# Altium schematic sheet Relay.SchDoc
size A4; SheetNumber: 6; SheetTotal: 8
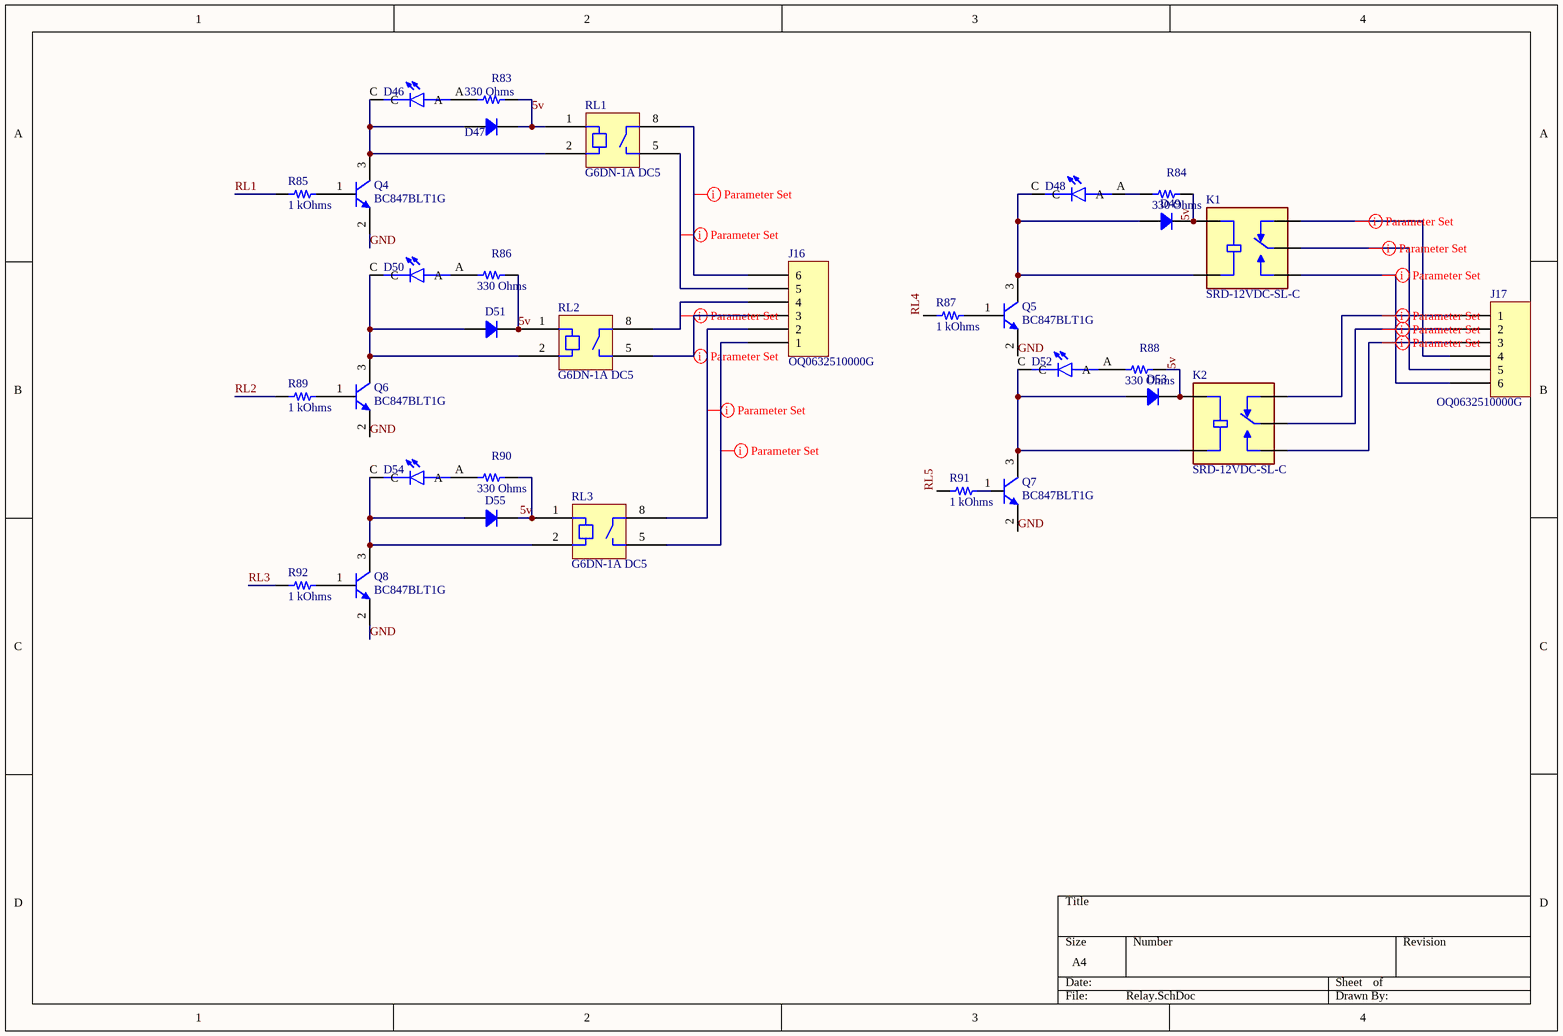
[diagram p0: Relay.SchDoc]

## Parts
D46  597-3305-607F  [LEDC2012X70N]  (value not drawn)
D47  CGRA4007-G  [DO214AC SMA]  (value not drawn)
D48  597-3305-607F  [LEDC2012X70N]  (value not drawn)
D49  CGRA4007-G  [DO214AC SMA]  (value not drawn)
D50  597-3305-607F  [LEDC2012X70N]  (value not drawn)
D51  CGRA4007-G  [DO214AC SMA]  (value not drawn)
D52  597-3305-607F  [LEDC2012X70N]  (value not drawn)
D53  CGRA4007-G  [DO214AC SMA]  (value not drawn)
D54  597-3305-607F  [LEDC2012X70N]  (value not drawn)
D55  CGRA4007-G  [DO214AC SMA]  (value not drawn)
J16  OQ0632510000G  [FCI 06-381-6PIN]
J17  OQ0632510000G  [FCI 06-381-6PIN]
K1  SRD-12VDC-SL-C  [RELAY_SRD-12VDC-SL-C]
K2  SRD-12VDC-SL-C  [RELAY_SRD-12VDC-SL-C]
Q4  BC847BLT1G  [ON SEMI SOT-23-3]
Q5  BC847BLT1G  [ON SEMI SOT-23-3]
Q6  BC847BLT1G  [ON SEMI SOT-23-3]
Q7  BC847BLT1G  [ON SEMI SOT-23-3]
Q8  BC847BLT1G  [ON SEMI SOT-23-3]
R83  330 Ohms  [RES 0805_2012]
R84  330 Ohms  [RES 0805_2012]
R85  1 kOhms  [RES 0805_2012]
R86  330 Ohms  [RES 0805_2012]
R87  1 kOhms  [RES 0805_2012]
R88  330 Ohms  [RES 0805_2012]
R89  1 kOhms  [RES 0805_2012]
R90  330 Ohms  [RES 0805_2012]
R91  1 kOhms  [RES 0805_2012]
R92  1 kOhms  [RES 0805_2012]
RL1  G6DN-1A DC5  [OMRON G6DN]
RL2  G6DN-1A DC5  [OMRON G6DN]
RL3  G6DN-1A DC5  [OMRON G6DN]

## Nets
5v: D47.2 D49.2 D51.2 D53.2 D55.2 K1.COIL1 K2.COIL1 R83.2 R84.2 R86.2 R88.2 R90.2 RL1.1(COIL1) RL2.1(COIL1) RL3.1(COIL1)
GND: Q4.2(E) Q5.2(E) Q6.2(E) Q7.2(E) Q8.2(E)
RL1: R85.1
RL2: R89.1
RL3: R92.1
RL4: R87.1
RL5: R91.1
NetD46_A: D46.A R83.1
NetD46_C: D46.C D47.1 Q4.3(C) RL1.2(COIL2)
NetD48_A: D48.A R84.1
NetD48_C: D48.C D49.1 K1.COIL2 Q5.3(C)
NetD50_A: D50.A R86.1
NetD50_C: D50.C D51.1 Q6.3(C) RL2.2(COIL2)
NetD52_A: D52.A R88.1
NetD52_C: D52.C D53.1 K2.COIL2 Q7.3(C)
NetD54_A: D54.A R90.1
NetD54_C: D54.C D55.1 Q8.3(C) RL3.2(COIL2)
NetJ16_1: J16.1 RL3.5(TERM1)
NetJ16_2: J16.2 RL3.8(TERM2)
NetJ16_3: J16.3 RL2.5(TERM1)
NetJ16_4: J16.4 RL2.8(TERM2)
NetJ16_5: J16.5 RL1.5(TERM1)
NetJ16_6: J16.6 RL1.8(TERM2)
NetJ17_1: J17.1 K2.NC
NetJ17_2: J17.2 K2.COM
NetJ17_3: J17.3 K2.NO
NetJ17_4: J17.4 K1.NC
NetJ17_5: J17.5 K1.COM
NetJ17_6: J17.6 K1.NO
NetQ4_1: Q4.1(B) R85.2
NetQ5_1: Q5.1(B) R87.2
NetQ6_1: Q6.1(B) R89.2
NetQ7_1: Q7.1(B) R91.2
NetQ8_1: Q8.1(B) R92.2

## Layout directives
net class High_current: NetJ16_1, NetJ16_2, NetJ16_3, NetJ16_4, NetJ16_5, NetJ16_6, NetJ17_1, NetJ17_2, NetJ17_3, NetJ17_4, NetJ17_5, NetJ17_6

## Library data of the parts
D46 D48 D50 D52 D54 = 597-3305-607F: LED Uni-Color Green 4-Pin Chip 0805 T/R; Availability: Unavailable; Value: *; Price: None; MP: 597-3305-607F; Package: None
D47 D49 D51 D53 D55 = CGRA4007-G: DIODE GEN PURP 1KV 1A DO214AC; Manufacturer: Comchip Technology; Current - Reverse Leakage @ Vr: 5 µA @ 1000 V; Diode Type: Standard; Speed: Standard Recovery >500ns, > 200mA (Io); Voltage - DC Reverse (Vr) (Max): 1000 V; Voltage - Forward (Vf) (Max) @ If: 1.1 V @ 1 A; Part Number: CGRA4007-G; ComponentLink1Description: Datasheet; ComponentLink1URL: http://www.comchiptech.com/admin/files/product/CGRA4001-G Thru647907. CGRA4007-G RevE.pdf; ComponentLink2Description: DigiKey Link; ComponentLink2URL: https://www.digikey.com/en/products/detail/comchip-technology/CGRA4007-G/1121050; Current - Average Rectified (Io): 1A; LastUpdated: 03-06-2024 7.54.36 PM; Lifecycle Status: Active; Minimum Order: 1; Mounting Type: Surface Mount; Operating Temperature - Junction: -55°C ~ 150°C; Package / Case: DO-214AC, SMA; Packaging: TapeAndReel; PartId: 670; Part Status: Active; Price: 0.04; Series: -; Supplier 1: DigiKey; Supplier Part Number 1: 641-1018-1-ND; Supplier Device Package: DO-214AC (SMA)
J16 J17 = OQ0632510000G: TERM BLOCK HDR 6POS 90DEG 3.81MM; Manufacturer: Amphenol Anytek; Current - UL: 10A; Header Orientation: 90°, Right Angle; Number of Levels: 1; Number of Positions: 6; Pitch: 0.150" (3.81mm); Voltage - UL: 300V; Part Number: OQ0632510000G; Color: Green; ComponentLink1Description: Datasheet; ComponentLink1URL: http://portal.fciconnect.com/Comergent//fci/drawing/oqxx32x100j0g.pdf; ComponentLink2Description: DigiKey Link; ComponentLink2URL: //digikey.com/product-detail/en/amphenol-anytek/OQ0632510000G/609-3823-ND/2261282; Contact Mating Finish: Tin; LastUpdated: 16-12-2019 7.16.11 PM; Lifecycle Status: 0; Minimum Order: 1; Mounting Type: Through Hole; Operating Temperature: -40°C ~ 115°C; Packaging: Bulk; Part Status: Active; Positions Per Level: 6; Price: 0.80; Series: 06-381; Supplier 1: DigiKey; Supplier Part Number 1: 609-3823-ND; Termination Style: Solder; Type: Header, Male Pins, Shrouded (4 Side)
K1 K2 = SRD-12VDC-SL-C: General Purpose Non Latching 12VDC SPDT Through Hole Relays RoHS; MF: Songle Relay; SnapEDA_Link: https://www.snapeda.com/parts/SRD-12VDC-SL-C/Songle+Relay/view-part/?ref=snap; Package: NON STANDARD-5 Songle Relay; Value: *; MP: SRD-12VDC-SL-C; Check_prices: https://www.snapeda.com/parts/SRD-12VDC-SL-C/Songle+Relay/view-part/?ref=eda
Q4-Q8 = BC847BLT1G: TRANS NPN 45V 0.1A SOT23; Manufacturer: ON Semiconductor; Current - Collector Cutoff (Max): 15nA (ICBO); Current - Collector (Ic) (Max): 100mA; DC Current Gain (hFE) (Min) @ Ic, Vce: 200 @ 2mA, 5V; Frequency - Transition: 100MHz; Power - Max: 300mW; Vce Saturation (Max) @ Ib, Ic: 600mV @ 5mA, 100mA; Part Number: BC847BLT1G; ComponentLink1Description: Datasheet; ComponentLink1URL: http://www.onsemi.com/pub/Collateral/BC846ALT1-D.PDF; ComponentLink2Description: DigiKey Link; ComponentLink2URL: http://digikey.com/product-detail/en/on-semiconductor/BC847BLT1G/BC847BLT1GOSCT-ND/917834; LastUpdated: 29-03-2026 8.43.49 PM; Lifecycle Status: Active; Minimum Order: 1; Mounting Type: Surface Mount; Operating Temperature: -55°C ~ 150°C (TJ); Package / Case: TO-236-3, SC-59, SOT-23-3; Packaging: TapeAndReel; PartId: 246; Part Status: Active; Price: 0.02; Series: -; Supplier 1: DigiKey; Supplier Part Number 1: BC847BLT1GOSCT-ND; Supplier Device Package: SOT-23-3 (TO-236); Transistor Type: NPN; Voltage - Collector Emitter Breakdown (Max): 45V
R83 R84 R86 R88 R90 = CRCW0805330RFKEAHP: RES SMD 330 OHM 1% 1/2W 0805; Manufacturer: Vishay Dale; Power (Watts): 0.5W, 1/2W; Temperature Coefficient: ±100ppm/°C; Part Number: CRCW0805330RFKEAHP; Value: 330 Ohms; ComponentLink1Description: Datasheet; ComponentLink1URL: http://www.vishay.com/docs/20043/crcwhpe3.pdf; ComponentLink2Description: DigiKey Link; ComponentLink2URL: https://www.digikey.com/en/products/detail/vishay-dale/CRCW0805330RFKEAHP/2226912; Composition: Thick Film; Device Package: 0805 (2012 Metric); Features: Automotive AEC-Q200, Pulse Withstanding; Height - Seated (Max): 0.020" (0.50mm); LastUpdated: 08-02-2024 9.02.28 PM; Lifecycle Status: Active; Minimum Order: 1; Number of Terminations: 2; Operating Temperature: -55°C ~ 155°C; Package / Case: 0805 (2012 Metric); Packaging: TapeAndReel; PartId: 30364; Part Status: Active; Price: 0.02; Ratings: AEC-Q200; Resistance: 330 Ohms; Series: CRCW-HP; Size / Dimension: 0.079" L x 0.049" W (2.00mm x 1.25mm); Supplier 1: DigiKey; Supplier Part Number 1: 541-330TCT-ND; Supplier Device Package: 0805; Tolerance: ±1%
R85 R87 R89 R91 R92 = ESR10EZPF1001: RES SMD 1K OHM 1% 0.4W 0805; Manufacturer: Rohm Semiconductor; Power (Watts): 0.4W, 2/5W; Temperature Coefficient: ±100ppm/°C; Part Number: ESR10EZPF1001; Value: 1 kOhms; ComponentLink1Description: Datasheet; ComponentLink1URL: https://www.rohm.com/datasheet/ESR01MZPF/esr-e; ComponentLink2Description: DigiKey Link; ComponentLink2URL: https://www.digikey.com/en/products/detail/rohm-semiconductor/ESR10EZPF1001/1983480; Composition: Thick Film; Device Package: 0805 (2012 Metric); Features: Automotive AEC-Q200, Pulse Withstanding; Height - Seated (Max): 0.026" (0.65mm); LastUpdated: 08-02-2024 9.02.37 PM; Lifecycle Status: Active; Minimum Order: 1; Number of Terminations: 2; Operating Temperature: -55°C ~ 155°C; Package / Case: 0805 (2012 Metric); Packaging: TapeAndReel; PartId: 28032; Part Status: Active; Price: 0.02; Ratings: AEC-Q200; Resistance: 1 kOhms; Series: ESR; Size / Dimension: 0.079" L x 0.049" W (2.00mm x 1.25mm); Supplier 1: DigiKey; Supplier Part Number 1: RHM1.00KAECT-ND; Supplier Device Package: 0805; Tolerance: ±1%
RL1-RL3 = G6DN-1A DC5: RELAY GEN PURPOSE SPST 5A 5V; Manufacturer: Omron Electronics Inc-EMC Div; Coil Current: 22 mA; Coil Insulation: Class B; Coil Type: Non Latching; Coil Voltage: 5VDC; Contact Form: SPST-NO (1 Form A); Must Operate Voltage: 3.5 VDC; Must Release Voltage: 0.25 VDC; Operate Time: 10 ms; Relay Type: General Purpose; Release Time: 5 ms; Seal Rating: Sealed - Fully; Switching Voltage: 277VAC, 125VDC - Max; Part Number: G6DN-1A DC5; ComponentLink1Description: Datasheet; ComponentLink1URL: https://omronfs.omron.com/en_US/ecb/products/pdf/en-g6dn.pdf; ComponentLink2Description: DigiKey Link; ComponentLink2URL: https://www.digikey.com/en/products/detail/omron-electronics-inc-emc-div/G6DN-1A-DC5/5864613; Contact Material: Silver Alloy; Contact Rating (Current): 5 A; LastUpdated: 16-08-2023 4.45.25 PM; Lifecycle Status: Active; Minimum Order: 1; Mounting Type: Through Hole; Operating Temperature: -40°C ~ 90°C; Packaging: Tube; Part Status: Active; Price: 1.26; Series: G6DN; Supplier 1: DigiKey; Supplier Part Number 1: Z5439-ND; Termination Style: PC Pin